# Altium schematic sheet Converter_shematic.SchDoc
size A4
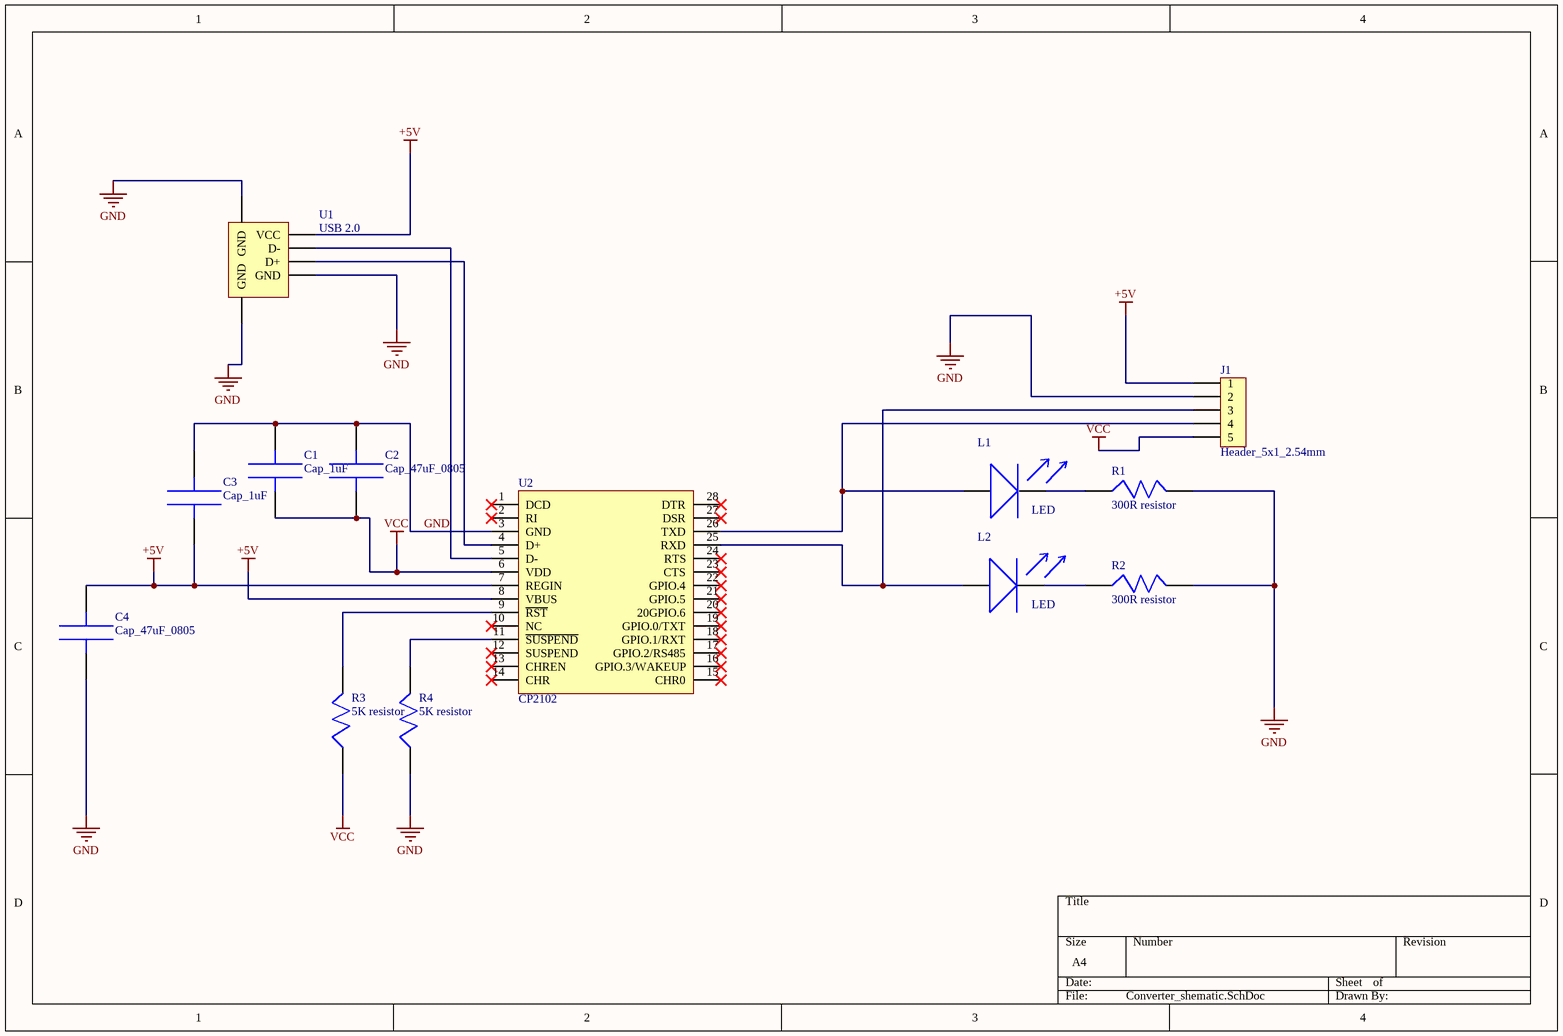
[diagram p0: Converter_shematic.SchDoc]

## Parts
C1  Cap_1uF  [Cap_1uF_0805]
C2  Cap_47uF_0805  [Cap_47uF_0805]
C3  Cap_1uF  [Cap_1uF_0805]
C4  Cap_47uF_0805  [Cap_47uF_0805]
J1  Header_5x1_2.54mm  [header_5]
L1  LED  [LED]
L2  LED  [LED]
R1  300R resistor  [Resistor_0805_300R]
R2  300R resistor  [Resistor_0805_300R]
R3  5K resistor  [Resistor_0805]
R4  5K resistor  [Resistor_0805]
U1  USB 2.0  [USB]
U2  CP2102  [CP2102]

## Nets
+5V: C3.1 C4.2 J1.1 U1.1(VCC) U2.7(REGIN) U2.8(VBUS)
GND: C1.2 C2.2 C3.2 C4.1 J1.2 R1.2 R2.2 R4.1 U1.4(GND) U1.5(GND) U1.6(GND) U2.3(GND)
VCC: C1.1 C2.1 J1.5 R3.1 U2.6(VDD)
NetJ1_3: J1.3 L2.1(Anode) U2.25(RXD)
NetJ1_4: J1.4 L1.1(Anode) U2.26(TXD)
NetL1_2: L1.2(Cathode) R1.1
NetL2_2: L2.2(Cathode) R2.1
NetR3_2: R3.2 U2.9(~{RST})
NetR4_2: R4.2 U2.11(~{SUSPEND})
NetU1_2: U1.2(D-) U2.5(D-)
NetU1_3: U1.3(D+) U2.4(D+)

Not connected (* = marked no-connect by the designer): U2 1(DCD)* 2(RI)* 10(NC)* 12(SUSPEND)* 13(CHREN)* 14(CHR)* 15(CHR0)* 16(GPIO.3/WAKEUP)* 17(GPIO.2/RS485)* 18(GPIO.1/RXT)* 19(GPIO.0/TXT)* 20(20GPIO.6)* 21(GPIO.5)* 22(GPIO.4)* 23(CTS)* 24(RTS)* 27(DSR)* 28(DTR)*

## Library data of the parts
C1 C3 = CAP 1uF: Supplier Part Number 1: 311-1886-1-ND; Supplier 1: Digi-Key
C2 C4 = Cap_47uF_0805: TDK   C2012X5R1A476M125AC   SMD Multilayer Ceramic Capacitor, C Series, 47 F,  20%, X5R, 10 V, 0805 [2012 Metric]; Capacitance: 47uF; Voltage Rating: 10V; Manufacturer: TDK; Manufacturer Part Number: C2012X5R1A476M125AC; RoHS: Yes; Category: Ceramic Capacitors; Stock 1: 56022; Pricing 1: 1=0,93000, 10=0,70800, 50=0,58800, 100=0,50640, 500=0,39204, 1000=0,33759 (USD); Mount: Surface Mount; Case/Package: 0805; Weight: 0.000194oz; Case Code (Metric): 2012; Case Code (Imperial): 0805; Dielectric Material: Ceramic; Min Operating Temperature: -55°C; Max Operating Temperature: 85°C; Tolerance: 20%; Packaging: Tape and Reel; Voltage Rating (DC): 10V; Dielectric: X5R; Termination: SMD/SMT; Package Quantity: 1; Composition: Ceramic; Voltage: 10V; Length: 2mm; Height: 1.25mm; Width: 0.049inch; Depth: 1.25mm; Thickness: 0.057inch; REACH SVHC: No SVHC; Lead Free: Lead Free; ComponentLink1URL: https://datasheet.ciiva.com/24216/c2012x5r1a476m125ac-264921-24216523.pdf?src-supplier=Mouser; ComponentLink1Description: https://datasheet.ciiva.com/24216/c2012x5r1a476m125ac-264921-24216523.pdf?src-supplier=Mouser; ComponentLink2URL: https://datasheet.ciiva.com/24191/c2012x5r1a476m125ac-24191773.pdf?src-supplier=Future+Electronics; ComponentLink2Description: https://datasheet.ciiva.com/24191/c2012x5r1a476m125ac-24191773.pdf?src-supplier=Future+Electronics; ComponentLink3URL: https://datasheet.ciiva.com/6259/tdkmlcccaprange-6259575.pdf?src-supplier=Digi-Key; ComponentLink3Description: https://datasheet.ciiva.com/6259/tdkmlcccaprange-6259575.pdf?src-supplier=Digi-Key; ComponentLink4URL: https://datasheet.ciiva.com/6259/tdkmlcccaprange-6259576.pdf?src-supplier=Digi-Key; ComponentLink4Description: https://datasheet.ciiva.com/6259/tdkmlcccaprange-6259576.pdf?src-supplier=Digi-Key; ComponentLink5URL: https://datasheet.ciiva.com/6259/tdkmlcccaprange-6259577.pdf?src-supplier=Digi-Key; ComponentLink5Description: https://datasheet.ciiva.com/6259/tdkmlcccaprange-6259577.pdf?src-supplier=Digi-Key; ComponentLink6URL: https://datasheet.ciiva.com/7975/1796654-7975085.pdf?src-supplier=Element14; ComponentLink6Description: https://datasheet.ciiva.com/7975/1796654-7975085.pdf?src-supplier=Element14; ComponentLink7URL: https://datasheet.ciiva.com/22694/1796654-22694142.pdf?src-supplier=Element14; ComponentLink7Description: https://datasheet.ciiva.com/22694/1796654-22694142.pdf?src-supplier=Element14; Supplier 1: Digi-Key; Supplier Part Number 1: 445-8239-1-ND
J1 = PH1RA-05-UA: HEADER, 2.54MM, VERTICAL THOUGH HOLE, 5 POSITION; Product Range:HTSW Series; Contact Termination Type:Through Hole; Gender:Header; No. of Contacts:5; Pitch Spacing:2.54mm; Contact Plating:Tin Plated Contacts; No. of Rows:1 ;RoHS Compliant: Yes; Manufacturer: Adam Equipment; Manufacturer Part Number: PH1RA-05-UA; RoHS: No; Category: Connectors; Stock 1: 3481; Pricing 1: 1=0,16000, 10=0,15100, 100=0,10480, 500=0,08866, 1000=0,07254, 5000=0,06448, 10000=0,05844 (USD); Lead Free: Lead Free; Supplier 1: Digi-Key; Supplier Part Number 1: 2057-PH1RA-05-UA-ND
L1 L2 = LTST-C171TBKT: LED BLUE CLEAR CHIP SMD; Manufacturer: Vishay Lite-On; Lens Color: Colorless; Wavelength: 468nm; Forward Current: 20mA; Forward Voltage: 3.8V; Luminous Intensity: 180mcd; Viewing Angle: 130°; Lens Style: Diffused,Colorless,Rectangular,Clear; Dominant Wavelength: 475nm; Number of LEDs: 1; Reverse Voltage: 5V; Power Dissipation: 76mW; Manufacturer Part Number: LTST-C171TBKT; RoHS: Yes; Category: LEDs; Stock 1: 7193; Pricing 1: 1=0,46000, 10=0,32800, 100=0,14560, 500=0,10192, 1000=0,08372 (USD); Mount: Surface Mount; Case/Package: 0805; Number of Pins: 2; Case Code (Imperial): 0805; Case Code (Metric): 2012; Color: Blue; Min Operating Temperature: -20°C; Max Operating Temperature: 80°C; Illumination Color: Blue; Packaging: Tape and Reel; Package Quantity: 1; Test Current: 20mA; Lens Transparency: Clear; Number of Elements: 1; Length: 2mm; Height: 0.8mm; Width: 1.25mm; Depth: 1.25mm; Radiation Hardening: No; Lead Free: Lead Free; ComponentLink1URL: https://datasheet.ciiva.com/2110/ltst-c171tbkt-2110304.pdf?src-supplier=Digi-Key; ComponentLink1Description: https://datasheet.ciiva.com/2110/ltst-c171tbkt-2110304.pdf?src-supplier=Digi-Key; ComponentLink2URL: https://datasheet.ciiva.com/15118/getdatasheetpartid-225754-15118121.pdf?src-supplier=Verical; ComponentLink2Description: https://datasheet.ciiva.com/15118/getdatasheetpartid-225754-15118121.pdf?src-supplier=Verical; ComponentLink3URL: https://datasheet.ciiva.com/11774/0900766b80dc029b-11774836.pdf?src-supplier=RSComponents; ComponentLink3Description: https://datasheet.ciiva.com/11774/0900766b80dc029b-11774836.pdf?src-supplier=RSComponents; ComponentLink4URL: https://datasheet.ciiva.com/12403/lite-on-ltst-c171tbkt-187246-12403800.pdf?src-supplier=Mouser; ComponentLink4Description: https://datasheet.ciiva.com/12403/lite-on-ltst-c171tbkt-187246-12403800.pdf?src-supplier=Mouser; ComponentLink5URL: https://datasheet.ciiva.com/2110/s-110-ltst-c171tbkt0630-2110305.pdf?src-supplier=Digi-Key; ComponentLink5Description: https://datasheet.ciiva.com/2110/s-110-ltst-c171tbkt0630-2110305.pdf?src-supplier=Digi-Key; ComponentLink6URL: https://datasheet.ciiva.com/16444/lite-onltst-c171tbkt-16444780.pdf?src-supplier=Future+Electronics; ComponentLink6Description: https://datasheet.ciiva.com/16444/lite-onltst-c171tbkt-16444780.pdf?src-supplier=Future+Electronics; Supplier 1: Digi-Key; Supplier Part Number 1: 160-1645-1-ND
R1 R2 = RC0805JR-07300RL: Res Thick Film 0805 300 Ohm 5% 1/8W 100ppm/C SMD Paper T/R; Manufacturer: Yageo; Temperature Coefficient: 100ppm/°C; Power Rating: 125mW; Voltage Rating: 150V; Manufacturer Part Number: RC0805JR-07300RL; RoHS: Yes; Category: Chip SMD Resistors; Stock 1: 560666; Pricing 1: 1=0,10000, 10=0,03300, 100=0,01350, 1000=0,00607, 2500=0,00527 (USD); Case/Package: 0805; Contact Plating: Tin,Matte,Lead; Case Code (Metric): 2012; Case Code (Imperial): 0805; Min Operating Temperature: -55°C; Max Operating Temperature: 155°C; Resistance: 300R; Tolerance: 5%; Composition: Thick Film; Package Quantity: 1; Packaging: Tape and Reel; Number of Terminations: 2; Termination: SMD/SMT; Military Standard: Not; Max Power Dissipation: 125mW; Voltage Rating (DC): 150V; Features: Moisture Resistant; Length: 2mm; Height: 0.024inch; Width: 0.049inch; Depth: 1.25mm; Radiation Hardening: No; Lead Free: Lead Free; ComponentLink1URL: https://datasheet.ciiva.com/2456/pyu-r-int-thick-7-2456273.pdf?src-supplier=Digi-Key; ComponentLink1Description: https://datasheet.ciiva.com/2456/pyu-r-int-thick-7-2456273.pdf?src-supplier=Digi-Key; ComponentLink2URL: https://datasheet.ciiva.com/2456/pyu-r-int-thick-7-2456274.pdf?src-supplier=Digi-Key; ComponentLink2Description: https://datasheet.ciiva.com/2456/pyu-r-int-thick-7-2456274.pdf?src-supplier=Digi-Key; ComponentLink3URL: https://datasheet.ciiva.com/2456/pyu-r-int-thick-7-2456275.pdf?src-supplier=Digi-Key; ComponentLink3Description: https://datasheet.ciiva.com/2456/pyu-r-int-thick-7-2456275.pdf?src-supplier=Digi-Key; Supplier 1: Digi-Key; Supplier Part Number 1: 311-300ARCT-ND
R3 R4 = Resistor_5K: RES SMD 5K OHM 0.05% 1/8W 0805; Manufacturer: Vishay Dale; Manufacturer Part Number: TNPU08055K00AZEN00; Resistance: 5kR; Max Power Dissipation: 125mW; Temperature Coefficient: 5ppm/°C; RoHS: No; Stock 1: 926; Pricing 1: 1=2,97000, 10=2,63400, 100=2,01120 (USD); Case/Package: 0805; Case Code (Imperial): 0805; Case Code (Metric): 2012; Min Operating Temperature: -55°C; Max Operating Temperature: 125°C; Composition: Thin Film; Features: Moisture Resistant,Automotive AEC-Q200,Anti-Sulfur; Packaging: Cut Tape; Tolerance: 0.05%; Number of Terminations: 2; ComponentLink1URL: http://www.vishay.com/docs/28779/tnpue3.pdf?src-supplier=Digi-Key; ComponentLink1Description: http://www.vishay.com/docs/28779/tnpue3.pdf?src-supplier=Digi-Key; Supplier 1: Digi-Key; Supplier Part Number 1: 541-3303-1-ND
U1 = USB 2.0: CONN PLUG USB A 4POS SMD R/A; Manufacturer: Molex; Manufacturer Part Number: 0480372200; Number of Contacts: 4; Number of Ports: 1; Max Voltage Rating (AC): 150V; Pitch: 2mm; RoHS: Yes; Category: Connectors; Stock 1: 12899; Pricing 1: 1=1,30000, 10=1,14400, 25=1,07720, 50=1,03220, 100=0,98740 (USD); Mount: Surface Mount,Horizontal; Housing Material: Nylon; Contact Plating: Tin,Gold; Number of Terminals: 4; Min Operating Temperature: -20°C; Max Operating Temperature: 85°C; Orientation: Right Angle; Packaging: Tape and Reel; Connector Type: USB; Termination: Solder; Features: Shielded; Package Quantity: 450; Length: 12mm; Depth: 18.75mm; Radiation Hardening: No; ComponentLink1URL: https://datasheet.ciiva.com/851/480372200-sd-851819.pdf?src-supplier=Digi-Key; ComponentLink1Description: https://datasheet.ciiva.com/851/480372200-sd-851819.pdf?src-supplier=Digi-Key; ComponentLink2URL: https://datasheet.ciiva.com/851/480372200-sd-851820.pdf?src-supplier=Digi-Key; ComponentLink2Description: https://datasheet.ciiva.com/851/480372200-sd-851820.pdf?src-supplier=Digi-Key; ComponentLink3URL: https://datasheet.ciiva.com/851/480372200-sd-851821.pdf?src-supplier=Digi-Key; ComponentLink3Description: https://datasheet.ciiva.com/851/480372200-sd-851821.pdf?src-supplier=Digi-Key; Supplier 1: Digi-Key; Supplier Part Number 1: WM3983CT-ND
U2 = CP2102: CP2102 UART-USB converter Module; Supplier 1: Digi-Key; Supplier Part Number 1: 336-5890-1-ND